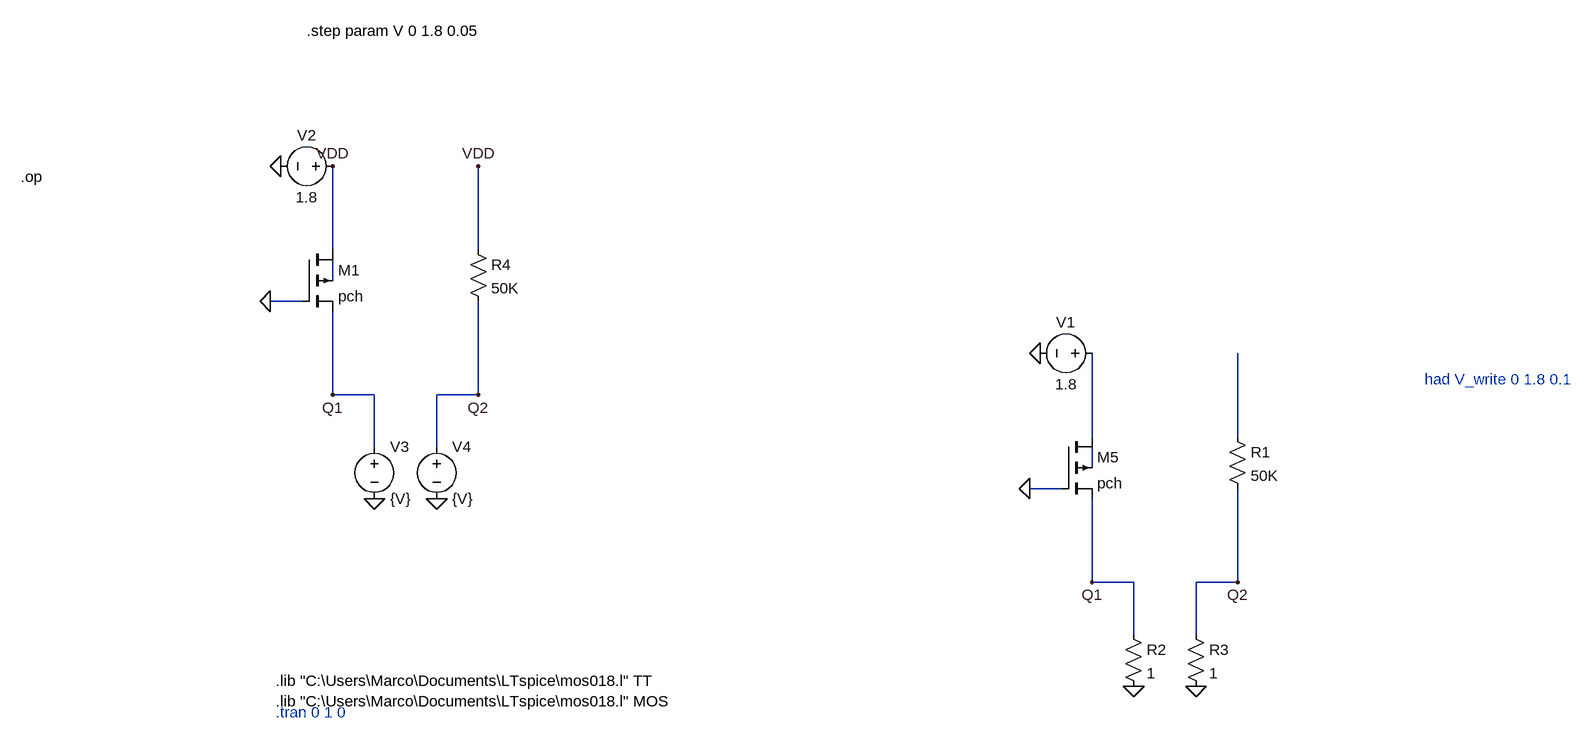
[diagram p0: schematic Sky130 PMOS Resistance Test.asc]
Sky130 PMOS Resistance Test.asc, the LTspice schematic file:
Version 4.1
SHEET 1 1364 828
WIRE -688 -448 -688 -576
WIRE -464 -448 -464 -576
WIRE -688 -400 -688 -432
WIRE -736 -368 -784 -368
WIRE -688 -224 -688 -352
WIRE -624 -224 -688 -224
WIRE -464 -224 -464 -368
WIRE -464 -224 -528 -224
WIRE 480 -160 480 -288
WIRE 704 -160 704 -288
WIRE -624 -144 -624 -224
WIRE -528 -144 -528 -224
WIRE 480 -112 480 -144
WIRE 432 -80 384 -80
WIRE 480 64 480 -64
WIRE 544 64 480 64
WIRE 704 64 704 -80
WIRE 704 64 640 64
WIRE 544 144 544 64
WIRE 640 144 640 64
FLAG 480 64 Q1
FLAG 704 64 Q2
FLAG 384 -80 0
FLAG 544 224 0
FLAG 640 224 0
FLAG 400 -288 0
FLAG -688 -224 Q1
FLAG -464 -224 Q2
FLAG -784 -368 0
FLAG -624 -64 0
FLAG -528 -64 0
FLAG -768 -576 0
FLAG -688 -576 VDD
FLAG -464 -576 VDD
SYMBOL pmos4 432 -160 R0
SYMATTR InstName M5
SYMATTR Value pch
SYMATTR Value2 l=432n w=420n
SYMBOL res 688 -176 R0
SYMATTR InstName R1
SYMATTR Value 50K
SYMBOL res 528 128 R0
SYMATTR InstName R2
SYMATTR Value 1
SYMBOL res 624 128 R0
SYMATTR InstName R3
SYMATTR Value 1
SYMBOL voltage 496 -288 R90
WINDOW 0 -32 56 VBottom 2
WINDOW 3 32 56 VTop 2
WINDOW 123 0 0 Left 0
WINDOW 39 0 0 Left 0
SYMATTR InstName V1
SYMATTR Value 1.8
SYMBOL pmos4 -736 -448 R0
SYMATTR InstName M1
SYMATTR Value pch
SYMATTR Value2 l=1.2u w=420n
SYMBOL res -480 -464 R0
SYMATTR InstName R4
SYMATTR Value 50K
SYMBOL voltage -672 -576 R90
WINDOW 0 -32 56 VBottom 2
WINDOW 3 32 56 VTop 2
WINDOW 123 0 0 Left 0
WINDOW 39 0 0 Left 0
SYMATTR InstName V2
SYMATTR Value 1.8
SYMBOL voltage -624 -160 R0
WINDOW 123 0 0 Left 0
WINDOW 39 0 0 Left 0
SYMATTR InstName V3
SYMATTR Value {V}
SYMBOL voltage -528 -160 R0
WINDOW 123 0 0 Left 0
WINDOW 39 0 0 Left 0
SYMATTR InstName V4
SYMATTR Value {V}
TEXT -776 216 Left 2 !.lib "C:\\Users\\Marco\\Documents\\LTspice\\mos018.l" TT\n.lib "C:\\Users\\Marco\\Documents\\LTspice\\mos018.l" MOS
TEXT 992 -248 Left 2 ;had V_write 0 1.8 0.1
TEXT -776 264 Left 2 ;.tran 0 1 0
TEXT -728 -784 Left 2 !.step param V 0 1.8 0.05
TEXT -1168 -560 Left 2 !.op

The netlist it stands for:
* Sky130 PMOS Resistance Test.asc
M5 N002 0 Q1 N004 pch l=432n w=420n
R1 N003 Q2 50K
R2 Q1 0 1
R3 Q2 0 1
V1 N002 0 1.8
M1 VDD 0 Q1 N001 pch l=1.2u w=420n
R4 VDD Q2 50K
V2 VDD 0 1.8
V3 Q1 0 {V}
V4 Q2 0 {V}
.model NMOS NMOS
.model PMOS PMOS
.lib standard.mos
.lib "C:\Users\Marco\Documents\LTspice\mos018.l" TT
.lib "C:\Users\Marco\Documents\LTspice\mos018.l" MOS
* had V_write 0 1.8 0.1
* .tran 0 1 0
.step param V 0 1.8 0.05
.op
.backanno
.end